# Altium schematic sheet RL_load.SchDoc
size A; SheetNumber: 2; SheetTotal: 2
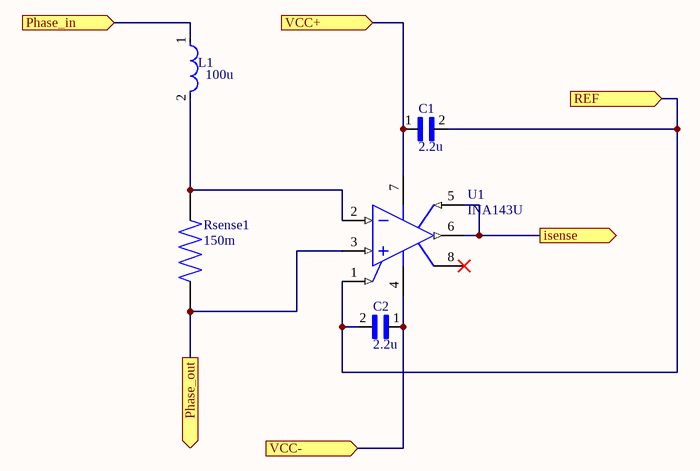
[diagram p0: RL_load.SchDoc]

## Parts
C1  2.2u
C2  2.2u
L1  100u
Rsense1  150m
U1  INA143U

## Ports
isense (out), Phase_in (in), Phase_out (out), REF (in), VCC+ (in), VCC- (in)

## Nets
isense: U1.5(SENSE) U1.6(OUTPUT) ; port isense
Phase_in: L1.1 ; port Phase_in
Phase_out: Rsense1.2 U1.3(IN+) ; port Phase_out
REF: C1.2 C2.2 U1.1(REF) ; port REF
VCC+: C1.1 U1.7(V+) ; port VCC+
VCC-: C2.1 U1.4(V-) ; port VCC-
NetL1_2: L1.2 Rsense1.1 U1.2(IN-)

Not connected (* = marked no-connect by the designer): U1 8(NC)*

## Library data of the parts
C1 C2 = GRM188R6YA225MA12D: CAP CER 2.2UF 35V X5R 0603; Manufacturer: Murata; Tolerance: 20%; Supplier 1: Digi-Key; Manufacturer Part Number: GRM188R6YA225MA12D; RoHS: Yes; Category: Ceramic Capacitors; Stock 1: 1598; Pricing 1: 1=0.19000, 10=0.13400, 50=0.07620, 100=0.06320, 500=0.04428, 1000=0.03666 (USD); Mount: Surface Mount; Case/Package: 0603; Case Code (Metric): 1608; Case Code (Imperial): 0603; Weight: 0.000222oz; Min Operating Temperature: -55°C; Max Operating Temperature: 85°C; Capacitance: 2.2uF; Packaging: Tape and Reel; Voltage Rating: 35V; Dielectric: X5R; Termination: SMD/SMT; Voltage Rating (DC): 35V; Package Quantity: 4000; Length: 0.063inch; Width: 0.031inch; Height: 0.8mm; Thickness: 0.035inch; RoHS Compliant: Yes; ComponentLink1URL: http://www.mouser.com/ds/2/281/c02e-2905.pdf?src-supplier=Mouser; ComponentLink1Description: http://www.mouser.com/ds/2/281/c02e-2905.pdf?src-supplier=Mouser; ComponentLink2URL: http://search.murata.co.jp/Ceramy/image/img/A01X/G101/ENG/GRM188R6YA225MA12-01.pdf?src-supplier=Digi-Key; ComponentLink2Description: http://search.murata.co.jp/Ceramy/image/img/A01X/G101/ENG/GRM188R6YA225MA12-01.pdf?src-supplier=Digi-Key; Supplier Part Number 1: 490-10486-1-ND
L1 = PA4344.104NLT: FIXED IND 100UH 5.3A 118 MOHM; Manufacturer: Pulse; Saturation Current: 6.5A; Shielding: Shielded; DC Resistance (DCR): 118mR; Test Frequency: 100kHz; Supplier 1: Digi-Key; Manufacturer Part Number: PA4344.104NLT; RoHS: Yes; Category: Fixed Inductors; Stock 1: 1739; Pricing 1: 1=3.77000, 10=3.59600, 25=3.42480, 50=2.87700, 100=2.46600 (USD); Mount: Surface Mount; Case/Package: Nonstandard; Min Operating Temperature: -40°C; Max Operating Temperature: 125°C; Packaging: Tape and Reel; Inductance: 100uH; Current Rating: 5.3A; Length: 0.697inch; Width: 0.677inch; Height - Seated (Max): 0.276inch; Ratings: AEC-Q200; RoHS Compliant: Yes; ComponentLink1URL: http://productfinder.pulseeng.com/products/datasheets/P771.pdf?src-supplier=Digi-Key; ComponentLink1Description: http://productfinder.pulseeng.com/products/datasheets/P771.pdf?src-supplier=Digi-Key; Supplier Part Number 1: 553-3011-1-ND
Rsense1 = 15FR150E: Resistor; Wirewound; Res 0.15 Ohms; Pwr-Rtg 5 W; Tol 1%; Axial; Silicone; Cur-Sense; Manufacturer: Ohmite; Resistance: 150mR; Power Rating: 5W; Voltage Rating: 100mV; Temperature Coefficient: 50ppm/°C; Voltage Rating (DC): 1kV; Lead Diameter: 0.05mm; Lead Length: 39.7mm; Body Diameter: 8.4mm; Body Length: 23.8mm; Supplier 1: Digi-Key; Manufacturer Part Number: 15FR150E; RoHS: Yes; Category: Through-Hole Resistors; Stock 1: 1147; Pricing 1: 1=3.11000, 10=2.77800, 25=2.61080, 50=2.38860, 100=2.05540, 250=1.77760, 500=1.61096, 1000=1.41652, 5000=1.36653 (USD); Mount: Through Hole; Case/Package: Axial; Number of Pins: 2; Min Operating Temperature: -55°C; Max Operating Temperature: 275°C; Tolerance: 1%; Package Quantity: 10; Packaging: Bulk; Termination: Axial; Resistor Type: Wirewound; Number of Terminations: 2; Max Power Dissipation: 5W; Series: 10; Resistance Tolerance: 1%; Diameter: 8.4mm; Length: 23.8mm; Lead Free: Lead Free; ComponentLink1URL: https://datasheet.ciiva.com/2716/res-10-2716526.pdf?src-supplier=Digi-Key; ComponentLink1Description: https://datasheet.ciiva.com/2716/res-10-2716526.pdf?src-supplier=Digi-Key; ComponentLink2URL: https://datasheet.ciiva.com/16771/70022566-16771081.pdf?src-supplier=Allied+Electronics; ComponentLink2Description: https://datasheet.ciiva.com/16771/70022566-16771081.pdf?src-supplier=Allied+Electronics; ComponentLink3URL: https://datasheet.ciiva.com/1131/66208-1131710.pdf?src-supplier=Element14; ComponentLink3Description: https://datasheet.ciiva.com/1131/66208-1131710.pdf?src-supplier=Element14; Supplier Part Number 1: 15FR150E-ND
U1 = INA143U: SP Amp Difference Amplifier Single ±18V/36V 8-Pin SOIC Tube; Manufacturer: Texas Instruments; Dual Supply Voltage: 15V; Min Dual Supply Voltage: 2.25V; Max Dual Supply Voltage: 18V; Bandwidth: 150kHz; Nominal Supply Current: 950uA; Common Mode Rejection Ratio: 86dB; Number of Channels: 1; Slew Rate: 5V/µs; Max Supply Voltage: 36V; Min Supply Voltage: 4.5V; Input Offset Voltage (Vos): 100uV; Voltage Gain: 20dB; Input Resistance: 55kR; Output Current per Channel: 32mA; Settling Time: 6us; Supplier 1: Digi-Key; Manufacturer Part Number: INA143U; RoHS: Yes; Category: Amplifiers - Op Amps, Buffer, Instrumentation; Stock 1: 417; Pricing 1: 1=4.01000, 10=3.60000, 25=3.40320, 100=2.79830, 250=2.51096, 500=2.42020, 1000=2.01178, 2500=1.99780 (USD); Case/Package: D; Number of Pins: 8; Weight: 0.002677oz; Min Operating Temperature: -40°C; Max Operating Temperature: 85°C; Package Quantity: 75; Packaging: Rail/Tube; Number of Circuits: 1; Number of Elements: 1; Quiescent Current: 950uA; Gain Bandwidth Product: 150kHz; -3db Bandwidth: 150kHz; Operating Supply Current: 950uA; Max Input Voltage: 36V; Min Input Voltage: 2.25V; Number of Amplifiers: 1; Length: 4.9mm; Width: 3.91mm; Height: 1.58mm; Radiation Hardening: No; Lead Free: Lead Free; REACH SVHC: No SVHC; ComponentLink1URL: https://datasheet.ciiva.com/19474/1341122-19474592.pdf?src-supplier=Jameco; ComponentLink1Description: https://datasheet.ciiva.com/19474/1341122-19474592.pdf?src-supplier=Jameco; ComponentLink2URL: https://datasheet.ciiva.com/15128/getdatasheetpartid-49975-15128159.pdf?src-supplier=Verical; ComponentLink2Description: https://datasheet.ciiva.com/15128/getdatasheetpartid-49975-15128159.pdf?src-supplier=Verical; ComponentLink3URL: https://datasheet.ciiva.com/1799/ina143-1799971.pdf?src-supplier=Digi-Key; ComponentLink3Description: https://datasheet.ciiva.com/1799/ina143-1799971.pdf?src-supplier=Digi-Key; ComponentLink4URL: https://datasheet.ciiva.com/2976/ina2143-2976117.pdf?src-supplier=Avnet; ComponentLink4Description: https://datasheet.ciiva.com/2976/ina2143-2976117.pdf?src-supplier=Avnet; ComponentLink5URL: https://datasheet.ciiva.com/26191/sbos116-26191078.pdf?src-supplier=Avnet+Europe; ComponentLink5Description: https://datasheet.ciiva.com/26191/sbos116-26191078.pdf?src-supplier=Avnet+Europe; ComponentLink6URL: https://datasheet.ciiva.com/1485/693952-1485228.pdf?src-supplier=Element14; ComponentLink6Description: https://datasheet.ciiva.com/1485/693952-1485228.pdf?src-supplier=Element14; ComponentLink7URL: https://datasheet.ciiva.com/48707/001010602-da-01-en-ic-opamp-diff-150khz-ina143u-soic-8-tid-48707338.pdf?src-supplier=Conrad; ComponentLink7Description: https://datasheet.ciiva.com/48707/001010602-da-01-en-ic-opamp-diff-150khz-ina143u-soic-8-tid-48707338.pdf?src-supplier=Conrad; Supplier Part Number 1: INA143U-ND